# EAGLE schematic Cassiopea (EAGLE 9.6.2)
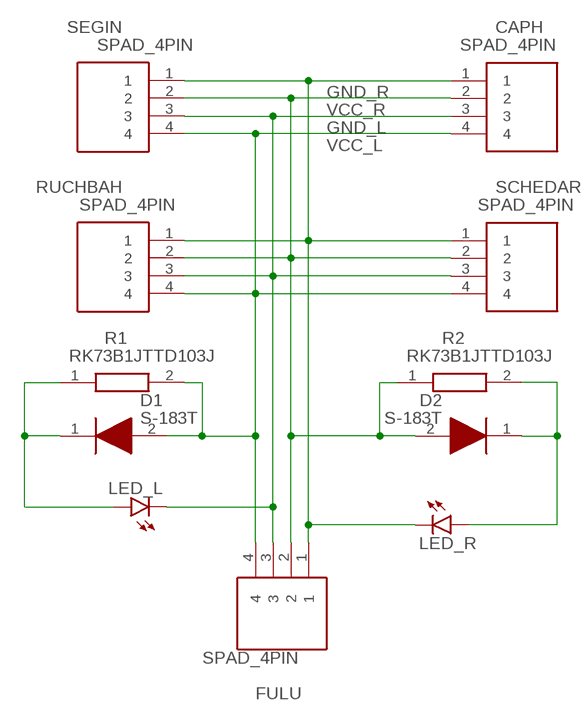
[diagram p0: schematic, sheet 1]

## Parts
CAPH  SPAD_4PIN  [SAPD_4PIN]
D1  S-183T  [SODFL3516X70N]
D2  S-183T  [SODFL3516X70N]
FULU  SPAD_4PIN  [SAPD_4PIN]
LED_L  LEDB155  [LED_FOOT]
LED_R  LEDB155  [LED_FOOT]
R1  RK73B1JTTD103J  [RESC1608X55N]
R2  RK73B1JTTD103J  [RESC1608X55N]
RUCHBAH  SPAD_4PIN  [SAPD_4PIN]
SCHEDAR  SPAD_4PIN  [SAPD_4PIN]
SEGIN  SPAD_4PIN  [SAPD_4PIN]

## Nets
GND_L: CAPH.3 FULU.3 LED_L.K(C) RUCHBAH.3 SCHEDAR.3 SEGIN.3
GND_R: CAPH.1 FULU.1 LED_R.K(C) RUCHBAH.1 SCHEDAR.1 SEGIN.1
N$1: D2.1(K) LED_R.A R2.2
N$2: D1.1(K) LED_L.A R1.1
VCC_L: CAPH.4 D1.2(A) FULU.4 R1.2 RUCHBAH.4 SCHEDAR.4 SEGIN.4
VCC_R: CAPH.2 D2.2(A) FULU.2 R2.1 RUCHBAH.2 SCHEDAR.2 SEGIN.2

## Library data of the parts
CAPH FULU RUCHBAH SCHEDAR SEGIN = LED_base:SPAD_4PIN: XH-2.5mm Header side entry 4 way JST XH Series, Series Number S4B, 2.5mm Pitch 4 Way 1 Row Right Angle PCB Header, Solder Termination, 3A Source: Datasheet <http://www.jst-mfg.com/product/pdf/eng/eXH.pdf>; DESCRIPTION: XH-2.5mm Header side entry 4 way JST XH Series, Series Number S4B, 2.5mm Pitch 4 Way 1 Row Right Angle PCB Header, Solder Termination, 3A; HEIGHT: 7mm; MANUFACTURER_NAME: JST (JAPAN SOLDERLESS TERMINALS); MANUFACTURER_PART_NUMBER: S4B-XH-A(LF)(SN)
D1 D2 = S-183T:S-183T: SEMITEC S-183T Constant Current Diode, 20mA, 4.6V max, 2-Pin SMD Source: Datasheet <https://componentsearchengine.com/Datasheets/1/S-183T.pdf>; DESCRIPTION: SEMITEC S-183T Constant Current Diode, 20mA, 4.6V max, 2-Pin SMD; HEIGHT: 0.7mm; MANUFACTURER_NAME: Semitec; MANUFACTURER_PART_NUMBER: S-183T; MOUSER_PART_NUMBER: 954-S-183T; MOUSER_PRICE-STOCK: https://www.mouser.com/Search/Refine.aspx?Keyword=954-S-183T
LED_L LED_R = LED_base:LED: LED OSRAM: - CHIPLED LG R971, LG N971, LY N971, LG Q971, LY Q971, LO R971, LY R971 LH N974, LH R974 LS Q976, LO Q976, LY Q976 LO Q996 - Hyper CHIPLED LW Q18S LB Q993, LB Q99A, LB R99A - SideLED LS A670, LO A670, LY A670, LG A670, LP A670 LB A673, LV A673, LT A673, LW A673 LH A674 LY A675 LS A676, LA A676, LO A676, LY A676, LW A676 LS A679, LY A679, LG A679 - Hyper Micro SIDELED® LS Y876, LA Y876, LO Y876, LY Y876 LT Y87S - SmartLED LW L88C, LW L88S LB L89C, LB L89S, LG L890 LS L89K, LO L89K, LY L89K LS L896, LA L896, LO L896, LY L896 - TOPLED LS T670, LO T670, LY T670, LG T670, LP T670 LSG T670, LSP T670, LSY T670, LOP T670, LYG T670 LG T671, LOG T671, LSG T671 LB T673, LV T673, LT T673, LW T673 LH T674 LS T676, LA T676, LO T676, LY T676, LB T676, LH T676, LSB T676, LW T676 LB T67C, LV T67C, LT T67C, LS T67K, LO T67K, LY T67K, LW E67C LS E67B, LA E67B, LO E67B, LY E67B, LB E67C, LV E67C, LT E67C LW T67C LS T679, LY T679, LG T679 LS T770, LO T770, LY T770, LG T770, LP T770 LB T773, LV T773, LT T773, LW T773 LH T774 LS E675, LA E675, LY E675, LS T675 LS T776, LA T776, LO T776, LY T776, LB T776 LHGB T686 LT T68C, LB T68C - Hyper Mini TOPLED® LB M676 - Mini TOPLED Santana® LG M470 LS M47K, LO M47K, LY M47K Source: http://www.osram.convergy.de LUXEON: - LUMILED® LXK2-PW12-R00, LXK2-PW12-S00, LXK2-PW14-U00, LXK2-PW14-V00 LXK2-PM12-R00, LXK2-PM12-S00, LXK2-PM14-U00 LXK2-PE12-Q00, LXK2-PE12-R00, LXK2-PE12-S00, LXK2-PE14-T00, LXK2-PE14-U00 LXK2-PB12-K00, LXK2-PB12-L00, LXK2-PB12-M00, LXK2-PB14-N00, LXK2-PB14-P00, LXK2-PB14-Q00 LXK2-PR12-L00, LXK2-PR12-M00, LXK2-PR14-Q00, LXK2-PR14-R00 LXK2-PD12-Q00, LXK2-PD12-R00, LXK2-PD12-S00 LXK2-PH12-R00, LXK2-PH12-S00 LXK2-PL12-P00, LXK2-PL12-Q00, LXK2-PL12-R00 Source: www.luxeon.com KINGBRIGHT: KA-3528ASYC Source: www.kingbright.com
R1 R2 = RK73B1JTTD103J:RK73B1JTTD103J: Thick Film Resistors - SMD 1/10watts 10Kohms 5% Source: Datasheet <http://www.koaspeer.com/catimages/Products/RK73B/RK73B.pdf>; DESCRIPTION: Thick Film Resistors - SMD 1/10watts 10Kohms 5%; HEIGHT: 0.55mm; MANUFACTURER_NAME: KOA Speer; MANUFACTURER_PART_NUMBER: RK73B1JTTD103J; MOUSER_PART_NUMBER: 660-RK73B1JTTD103J; MOUSER_PRICE-STOCK: https://www.mouser.co.uk/ProductDetail/KOA-Speer/RK73B1JTTD103J?qs=hmtrJ2UjXcBKRTcwO9LloQ%3D%3D

## Net classes
0 default: clearance 0.305 mm